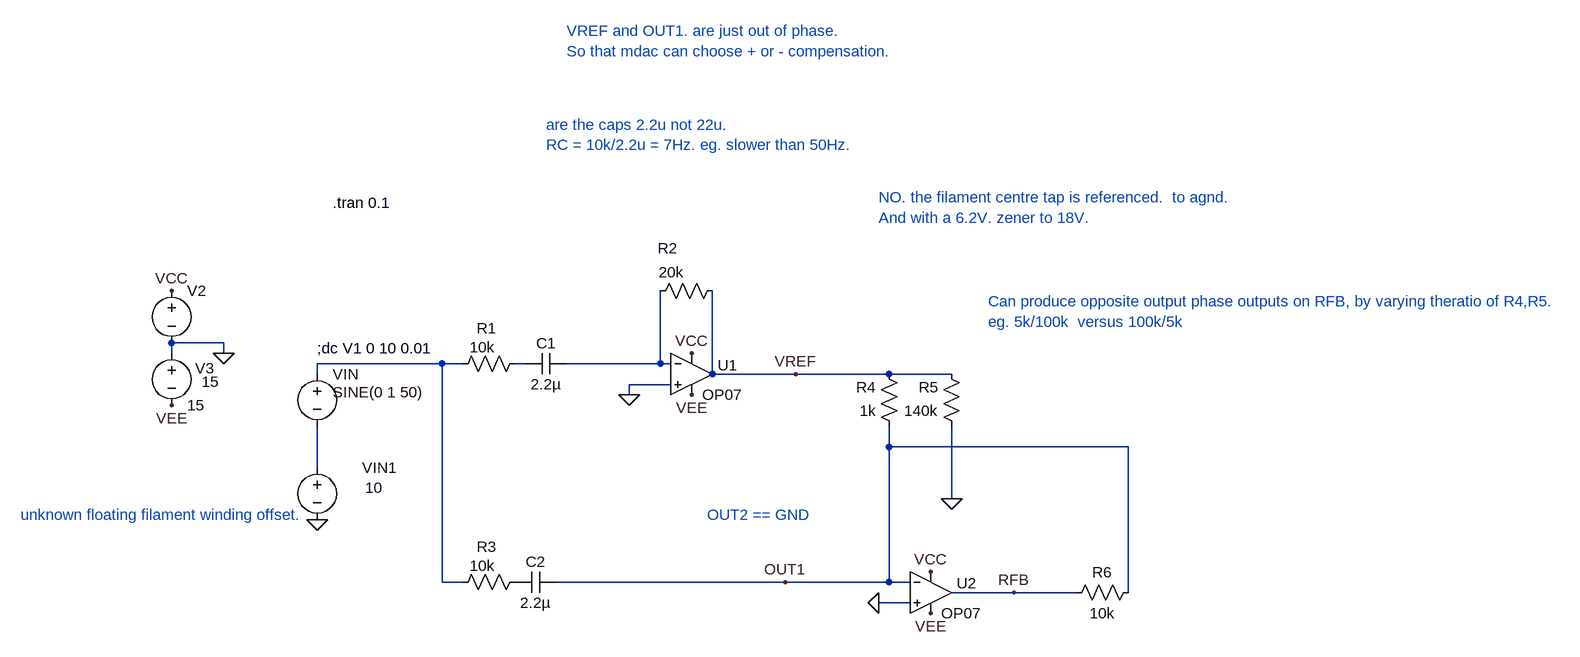
[diagram p0: schematic Draft01.asc]
Draft01.asc, the LTspice schematic file:
Version 4
SHEET 1 1924 680
WIRE -192 80 -272 80
WIRE -272 96 -272 80
WIRE -192 96 -192 80
WIRE 144 112 -48 112
WIRE 176 112 144 112
WIRE 272 112 256 112
WIRE 480 112 480 0
WIRE 480 112 336 112
WIRE 496 112 480 112
WIRE -48 128 -48 112
WIRE 560 128 560 0
WIRE 688 128 560 128
WIRE 832 128 688 128
WIRE 928 128 832 128
WIRE 496 144 432 144
WIRE 432 160 432 144
WIRE 832 240 832 208
WIRE 1200 240 832 240
WIRE -48 272 -48 208
WIRE 928 320 928 208
WIRE 144 448 144 112
WIRE 176 448 144 448
WIRE 672 448 320 448
WIRE 832 448 832 240
WIRE 832 448 672 448
WIRE 864 448 832 448
WIRE 1024 464 928 464
WIRE 1120 464 1024 464
WIRE 1200 464 1200 240
WIRE 864 480 816 480
FLAG -192 96 0
FLAG 688 128 VREF
FLAG -48 352 0
FLAG -272 0 VCC
FLAG 528 96 VCC
FLAG -272 176 VEE
FLAG 528 160 VEE
FLAG 432 160 0
FLAG 672 448 OUT1
FLAG 896 432 VCC
FLAG 896 496 VEE
FLAG 928 320 0
FLAG 816 480 0
FLAG 1024 464 RFB
SYMBOL voltage -48 112 R0
WINDOW 123 0 0 Left 0
WINDOW 39 0 0 Left 0
WINDOW 3 24 44 Left 2
SYMATTR Value SINE(0 1 50)
SYMATTR InstName VIN
SYMBOL OpAmps\\OP07 528 64 R0
WINDOW 0 40 50 Left 2
SYMATTR InstName U1
SYMBOL voltage -272 -16 R0
WINDOW 123 0 0 Left 0
WINDOW 39 0 0 Left 0
WINDOW 3 46 156 Left 2
SYMATTR Value 15
SYMATTR InstName V2
SYMBOL voltage -272 80 R0
WINDOW 123 0 0 Left 0
WINDOW 39 0 0 Left 0
WINDOW 0 36 39 Left 2
SYMATTR InstName V3
SYMATTR Value 15
SYMBOL res 272 96 R90
WINDOW 0 -23 59 VBottom 2
WINDOW 3 -25 66 VTop 2
SYMATTR InstName R1
SYMATTR Value 10k
SYMBOL res 576 -16 R90
WINDOW 0 -34 85 VBottom 2
WINDOW 3 -28 79 VTop 2
SYMATTR InstName R2
SYMATTR Value 20k
SYMBOL cap 336 96 R90
WINDOW 0 0 32 VBottom 2
WINDOW 3 32 32 VTop 2
SYMATTR InstName C1
SYMATTR Value 2.2µ
SYMBOL voltage -48 256 R0
WINDOW 123 0 0 Left 0
WINDOW 39 0 0 Left 0
WINDOW 3 74 47 Left 2
WINDOW 0 69 16 Left 2
SYMATTR Value 10
SYMATTR InstName VIN1
SYMBOL res 272 432 R90
WINDOW 0 -23 59 VBottom 2
WINDOW 3 -25 66 VTop 2
SYMATTR InstName R3
SYMATTR Value 10k
SYMBOL cap 320 432 R90
WINDOW 0 0 32 VBottom 2
WINDOW 3 32 32 VTop 2
SYMATTR InstName C2
SYMATTR Value 2.2µ
SYMBOL OpAmps\\OP07 896 400 R0
WINDOW 0 40 50 Left 2
SYMATTR InstName U2
SYMBOL res 848 224 R180
WINDOW 0 36 76 Left 2
WINDOW 3 36 40 Left 2
SYMATTR InstName R4
SYMATTR Value 1k
SYMBOL res 944 224 R180
WINDOW 0 36 76 Left 2
WINDOW 3 36 40 Left 2
SYMATTR InstName R5
SYMATTR Value 140k
SYMBOL res 1104 480 R270
WINDOW 0 32 56 VTop 2
WINDOW 3 0 56 VBottom 2
SYMATTR InstName R6
SYMATTR Value 10k
TEXT -48 88 Left 2 !;dc V1 0 10 0.01
TEXT -24 -136 Left 2 !.tran 0.1
TEXT 336 -400 Left 2 ;VREF and OUT1. are just out of phase.\nSo that mdac can choose + or - compensation.
TEXT -504 344 Left 2 ;unknown floating filament winding offset.
TEXT 304 -256 Left 2 ;are the caps 2.2u not 22u.\nRC = 10k/2.2u = 7Hz. eg. slower than 50Hz.
TEXT 552 344 Left 2 ;OUT2 == GND
TEXT 984 16 Left 2 ;Can produce opposite output phase outputs on RFB, by varying theratio of R4,R5.\neg. 5k/100k  versus 100k/5k
TEXT 816 -144 Left 2 ;NO. the filament centre tap is referenced.  to agnd.\nAnd with a 6.2V. zener to 18V.

The netlist it stands for:
* Draft01.asc
VIN N001 N004 SINE(0 1 50)
XU1 0 N003 VCC VEE VREF LT1001  ; OP07, pins In+ In- V+ V- OUT
V2 VCC 0 15
V3 0 VEE 15
R1 N002 N001 10k
R2 VREF N003 20k
C1 N003 N002 2.2µ
VIN1 N004 0 10
R3 P001 N001 10k
C2 OUT1 P001 2.2µ
XU2 0 OUT1 VCC VEE RFB LT1001  ; OP07, pins In+ In- V+ V- OUT
R4 OUT1 VREF 1k
R5 0 VREF 140k
R6 RFB OUT1 10k
;dc V1 0 10 0.01
.tran 0.1
* VREF and OUT1. are just out of phase.
* So that mdac can choose + or - compensation.
* unknown floating filament winding offset.
* are the caps 2.2u not 22u.
* RC = 10k/2.2u = 7Hz. eg. slower than 50Hz.
* OUT2 == GND
* Can produce opposite output phase outputs on RFB, by varying theratio of R4,R5.
* eg. 5k/100k  versus 100k/5k
* NO. the filament centre tap is referenced.  to agnd.
* And with a 6.2V. zener to 18V.
.lib LTC.lib
.backanno
.end